# EAGLE design PIC32 (EAGLE 5.12)
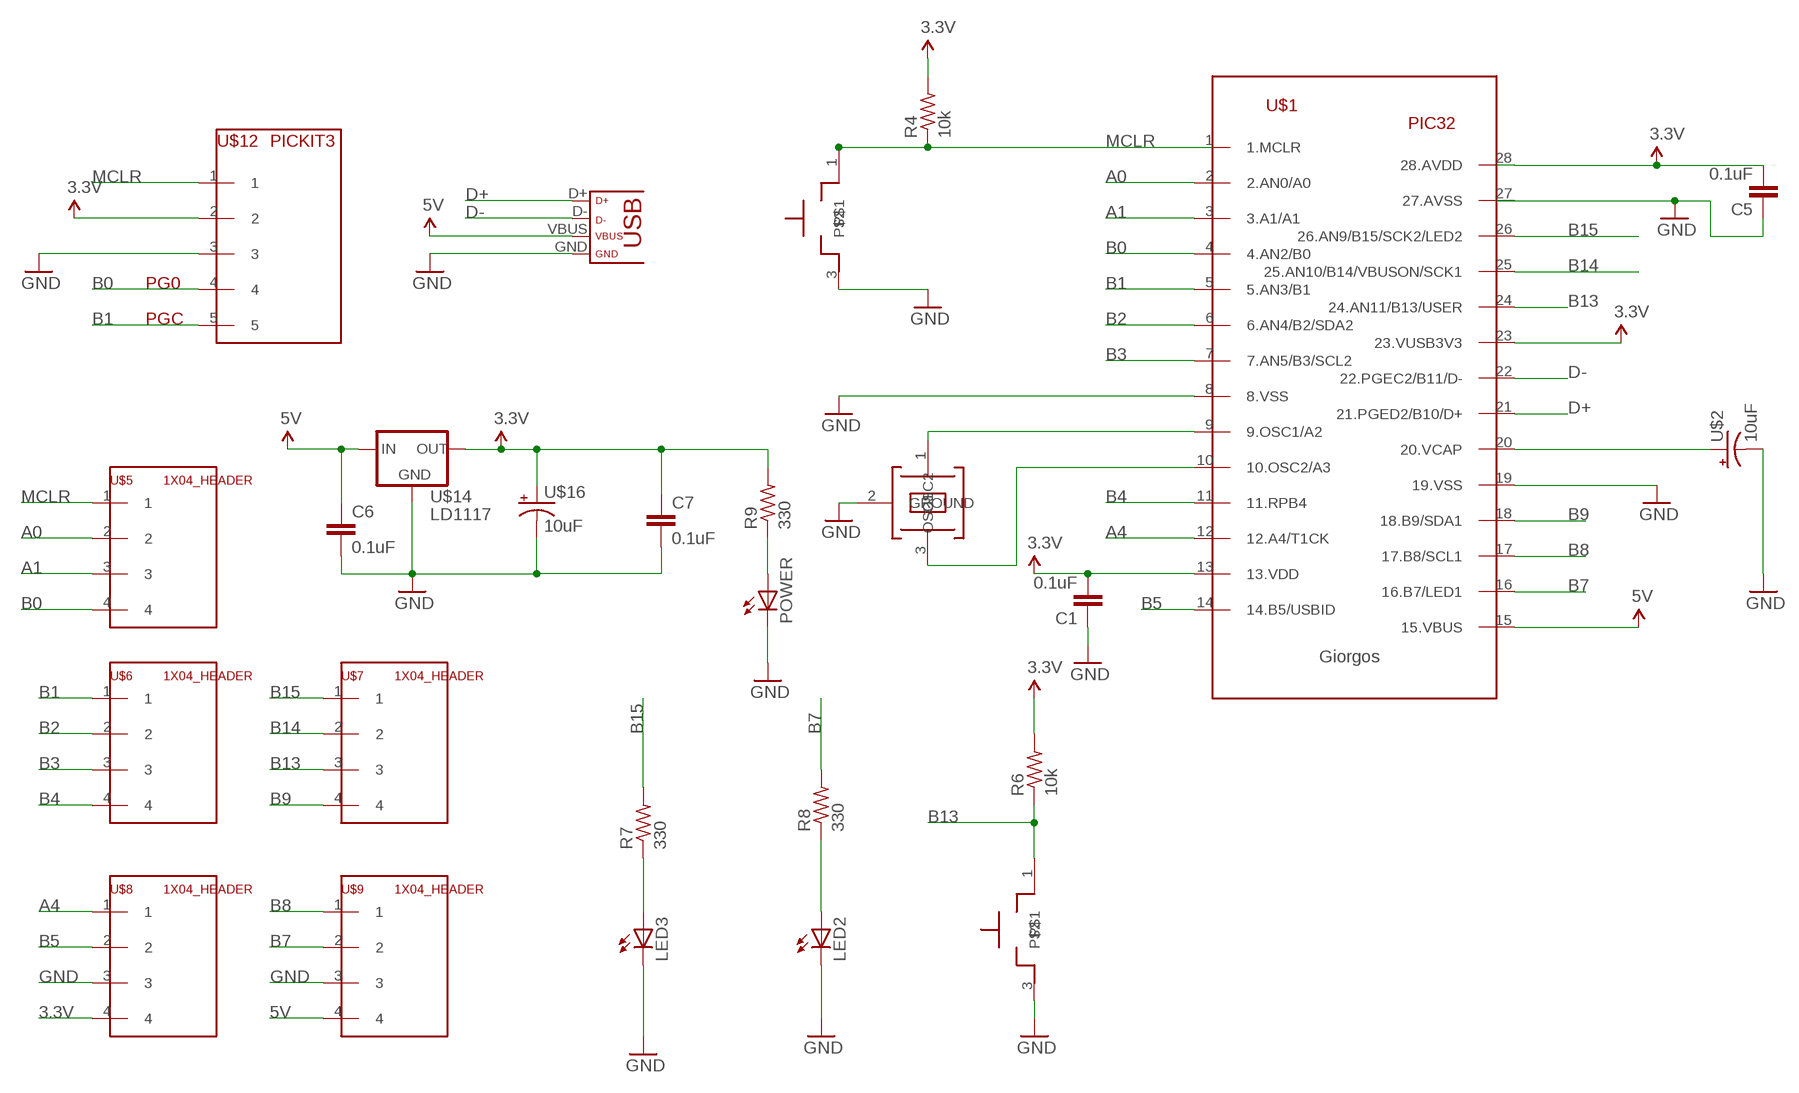
[diagram p0: schematic, sheet 1]

## Parts
C1  0.1uF  C-EU025-024X044  [C025-024X044]
C5  0.1uF  C-EU025-024X044  [C025-024X044]
C6  0.1uF  C-EU025-024X044  [C025-024X044]
C7  0.1uF  C-EU025-024X044  [C025-024X044]
LED2  LED3MM  [LED3MM]
LED3  LED3MM  [LED3MM]
POWER  LED3MM  [LED3MM]
R4  10k  R-US_0207/7  [0207/7]
R6  10k  R-US_0207/7  [0207/7]
R7  330  R-US_0207/7  [0207/7]
R8  330  R-US_0207/7  [0207/7]
R9  330  R-US_0207/7  [0207/7]
U$1  PIC32  [DIL28-3]
U$2  10uF  CAP_POL  [CAP_POL_D]
U$4  PUSHBUTTON  [1X03]
U$5  1X04_HEADER  [1X04]
U$6  1X04_HEADER  [1X04]
U$7  1X04_HEADER  [1X04]
U$8  1X04_HEADER  [1X04]
U$9  1X04_HEADER  [1X04]
U$10  PUSHBUTTON  [1X03]
U$11  USB  [USB-MINIB]
U$12  PICKIT3  [1X05]
U$14  LD1117  [TO220]
U$16  10uF  CAP_POL  [CAP_POL_D]
U$17  8MHZ_RESONATOR  [1X03]

## Nets
3.3V: C1.2 C5.2 C7.1 R4.2 R6.2 R9.2 U$1.13(13.VDD) U$1.23(23.VUSB3V3) U$1.28(28.AVDD) U$8.4 U$12.2 U$14.2(OUT) U$16.1(+)
5V: C6.1 U$1.15(15.VBUS) U$9.4 U$11.VBUS U$14.3(IN)
A0: U$1.2(2.AN0/A0) U$5.2
A1: U$1.3(3.A1/A1) U$5.3
A4: U$1.12(12.A4/T1CK) U$8.1
B0: U$1.4(4.AN2/B0) U$5.4 U$12.4
B1: U$1.5(5.AN3/B1) U$6.1 U$12.5
B2: U$1.6(6.AN4/B2/SDA2) U$6.2
B3: U$1.7(7.AN5/B3/SCL2) U$6.3
B4: U$1.11(11.RPB4) U$6.4
B5: U$1.14(14.B5/USBID) U$8.2
B7: R8.2 U$1.16(16.B7/LED1) U$9.2
B8: U$1.17(17.B8/SCL1) U$9.1
B9: U$1.18(18.B9/SDA1) U$7.4
B13: R6.1 U$1.24(24.AN11/B13/USER) U$7.3 U$10.1
B14: U$1.25(25.AN10/B14/VBUSON/SCK1) U$7.2
B15: R7.2 U$1.26(26.AN9/B15/SCK2/LED2) U$7.1
D+: U$1.21(21.PGED2/B10/D+) U$11.D+
D-: U$1.22(22.PGEC2/B11/D-) U$11.D-
GND: C1.1 C5.1 C6.2 C7.2 LED2.K(C) LED3.K(C) POWER.K(C) U$1.8(8.VSS) U$1.19(19.VSS) U$1.27(27.AVSS) U$2.2(-) U$4.3 U$8.3 U$9.3 U$10.3 U$11.GND U$12.3 U$14.1(GND) U$16.2(-) U$17.2(GROUND)
MCLR: R4.1 U$1.1(1.MCLR) U$4.1 U$5.1 U$12.1
N$1: U$1.9(9.OSC1/A2) U$17.1(OSC1)
N$2: U$1.10(10.OSC2/A3) U$17.3(OSC2)
N$3: U$1.20(20.VCAP) U$2.1(+)
N$4: LED2.A R8.1
N$5: LED3.A R7.1
N$7: POWER.A R9.1

## Library data of the parts
C1 C5-C7 = ME433:C-EU: CAPACITOR, European symbol
LED2 LED3 POWER = ME433:LED: LED OSRAM: - CHIPLED LG R971, LG N971, LY N971, LG Q971, LY Q971, LO R971, LY R971 LH N974, LH R974 LS Q976, LO Q976, LY Q976 LO Q996 - Hyper CHIPLED LW Q18S LB Q993, LB Q99A, LB R99A - SideLED LS A670, LO A670, LY A670, LG A670, LP A670 LB A673, LV A673, LT A673, LW A673 LH A674 LY A675 LS A676, LA A676, LO A676, LY A676, LW A676 LS A679, LY A679, LG A679 - Hyper Micro SIDELED® LS Y876, LA Y876, LO Y876, LY Y876 LT Y87S - SmartLED LW L88C, LW L88S LB L89C, LB L89S, LG L890 LS L89K, LO L89K, LY L89K LS L896, LA L896, LO L896, LY L896 - TOPLED LS T670, LO T670, LY T670, LG T670, LP T670 LSG T670, LSP T670, LSY T670, LOP T670, LYG T670 LG T671, LOG T671, LSG T671 LB T673, LV T673, LT T673, LW T673 LH T674 LS T676, LA T676, LO T676, LY T676, LB T676, LH T676, LSB T676, LW T676 LB T67C, LV T67C, LT T67C, LS T67K, LO T67K, LY T67K, LW E67C LS E67B, LA E67B, LO E67B, LY E67B, LB E67C, LV E67C, LT E67C LW T67C LS T679, LY T679, LG T679 LS T770, LO T770, LY T770, LG T770, LP T770 LB T773, LV T773, LT T773, LW T773 LH T774 LS E675, LA E675, LY E675, LS T675 LS T776, LA T776, LO T776, LY T776, LB T776 LHGB T686 LT T68C, LB T68C - Hyper Mini TOPLED® LB M676 - Mini TOPLED Santana® LG M470 LS M47K, LO M47K, LY M47K Source: http://www.osram.convergy.de LUXEON: - LUMILED® LXK2-PW12-R00, LXK2-PW12-S00, LXK2-PW14-U00, LXK2-PW14-V00 LXK2-PM12-R00, LXK2-PM12-S00, LXK2-PM14-U00 LXK2-PE12-Q00, LXK2-PE12-R00, LXK2-PE12-S00, LXK2-PE14-T00, LXK2-PE14-U00 LXK2-PB12-K00, LXK2-PB12-L00, LXK2-PB12-M00, LXK2-PB14-N00, LXK2-PB14-P00, LXK2-PB14-Q00 LXK2-PR12-L00, LXK2-PR12-M00, LXK2-PR14-Q00, LXK2-PR14-R00 LXK2-PD12-Q00, LXK2-PD12-R00, LXK2-PD12-S00 LXK2-PH12-R00, LXK2-PH12-S00 LXK2-PL12-P00, LXK2-PL12-Q00, LXK2-PL12-R00 Source: www.luxeon.com KINGBRIGHT: KA-3528ASYC Source: www.kingbright.com
R4 R6-R9 = resistor:R-US_: RESISTOR, American symbol
U$1 = ME433:PIC32
U$2 U$16 = ME433:CAP_POL
U$4 U$10 = ME433:PUSHBUTTON
U$5-U$9 = ME433:1X04_HEADER
U$11 = ME433:USB
U$12 = ME433:PICKIT3
U$14 = ME433:LD1117
U$17 = ME433:8MHZ_RESONATOR

## Board
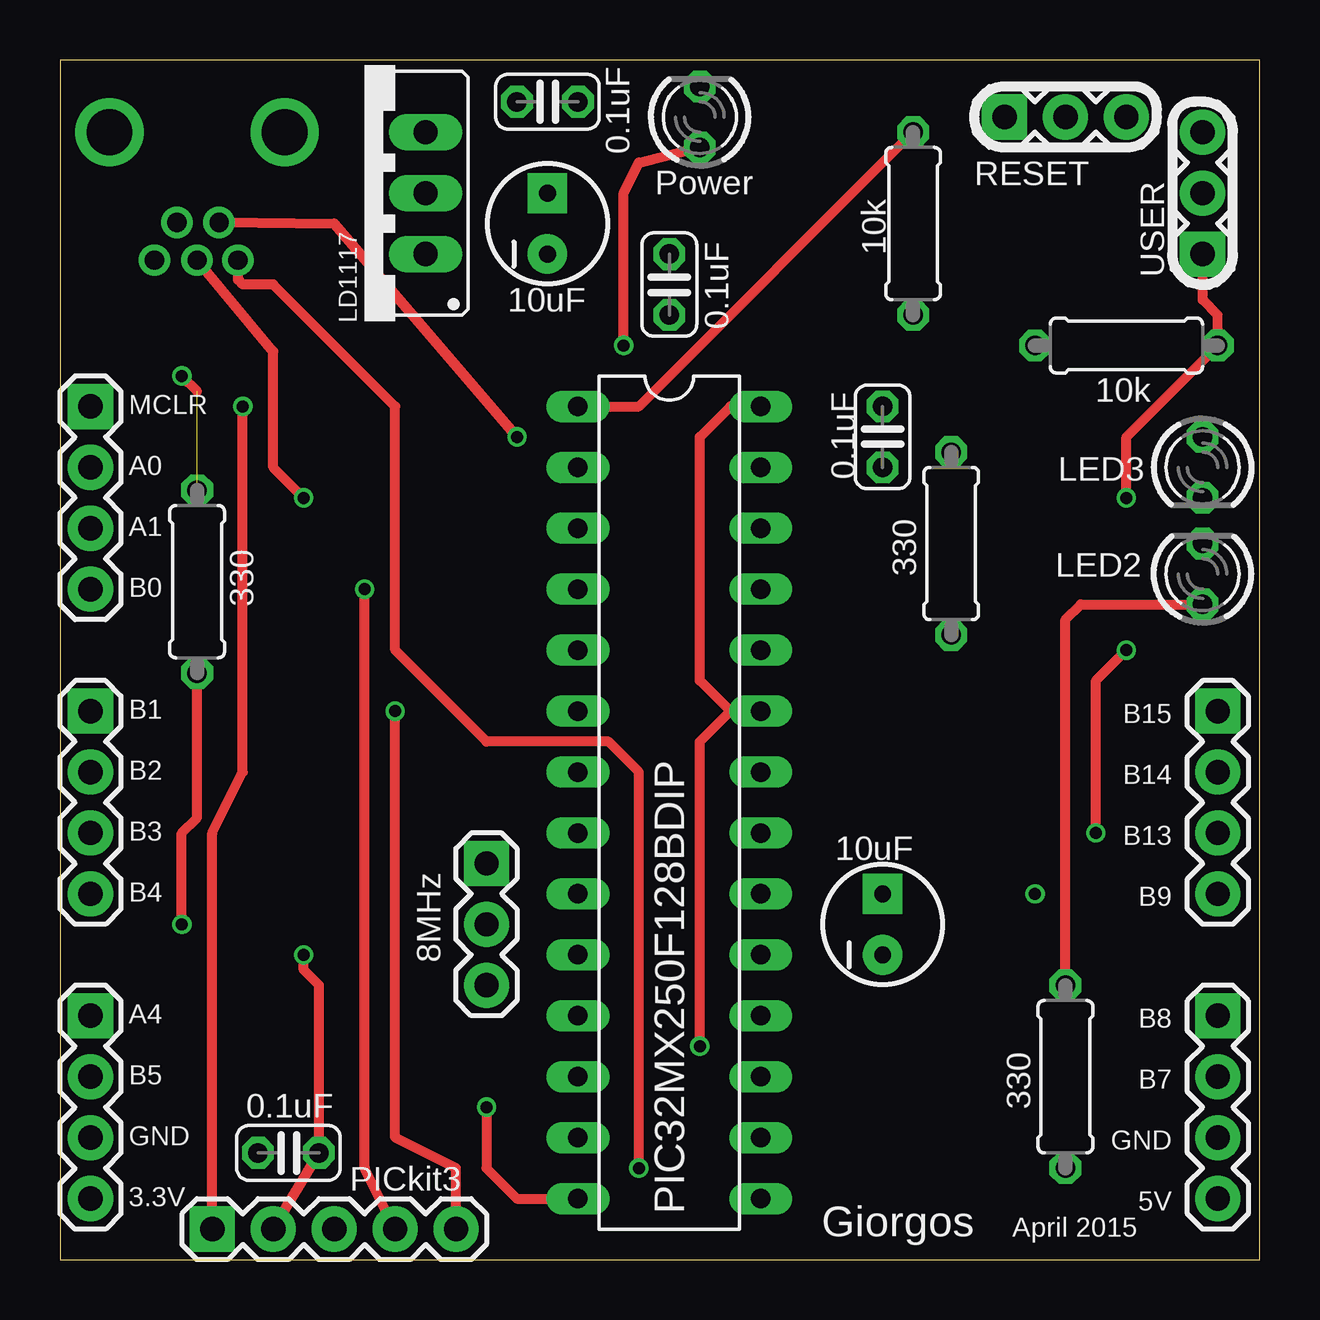
[diagram p1: board, top side]
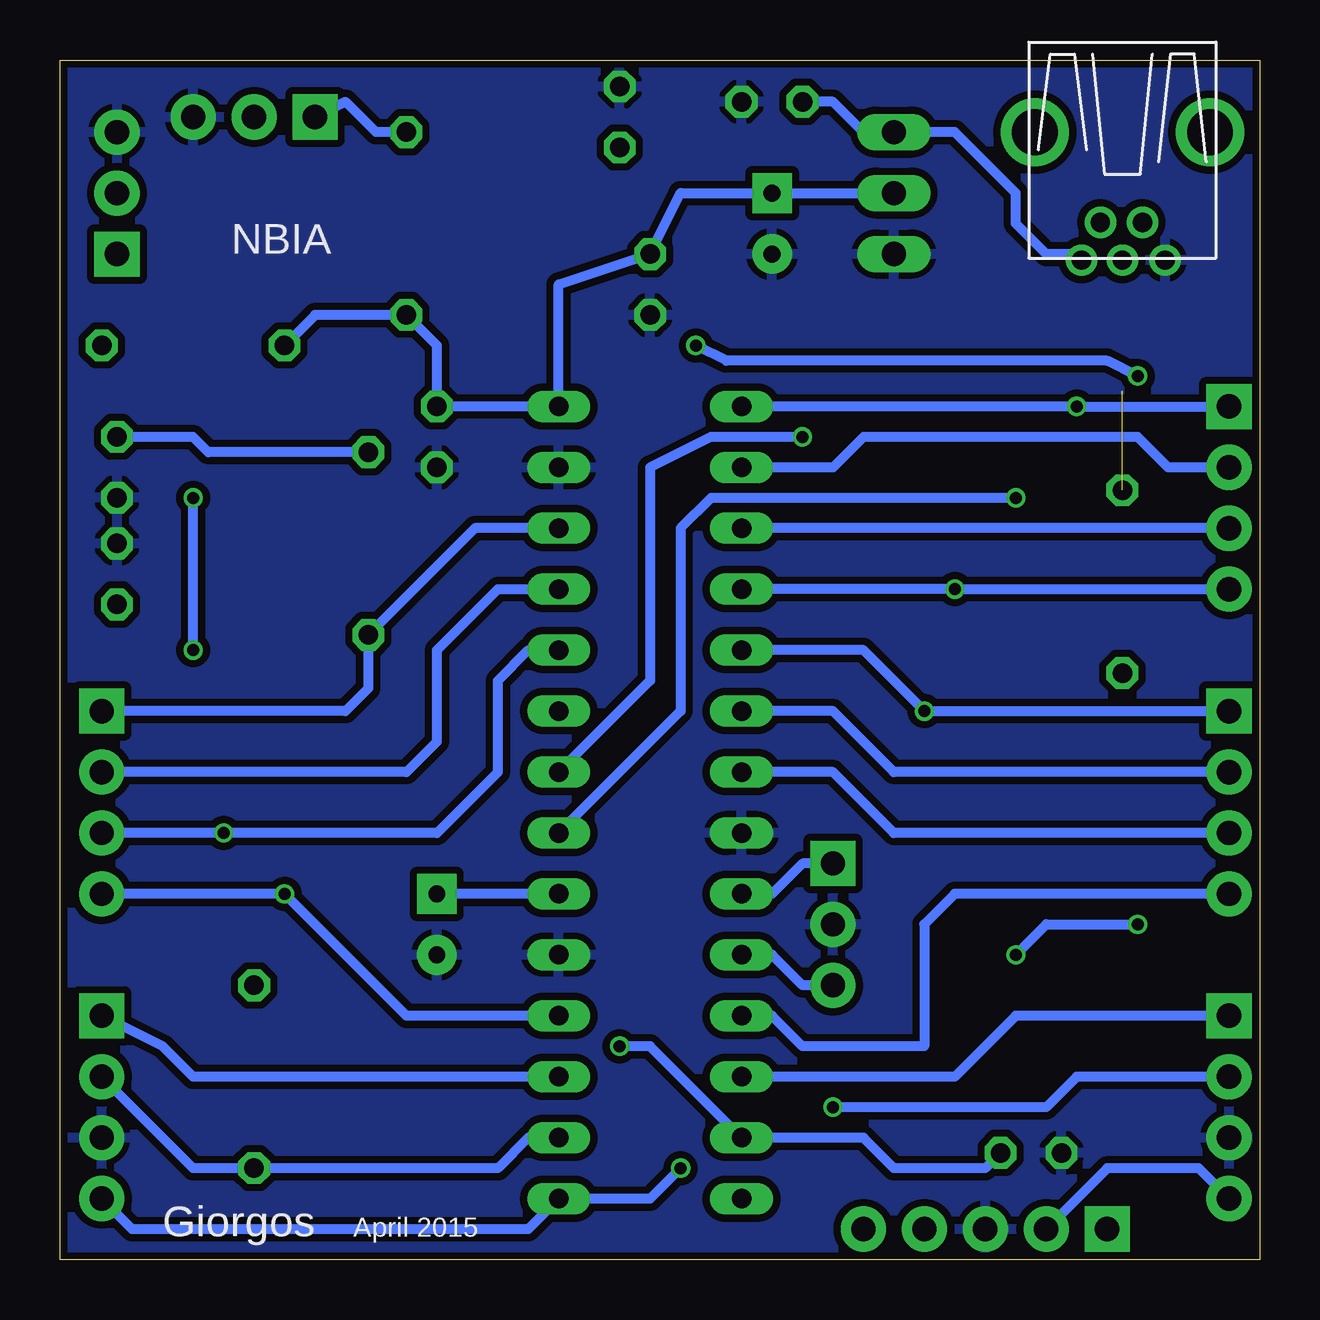
[diagram p2: board, bottom side, seen from below]

Size 50 x 50 mm. Coordinates in mm from the lower left corner, seen from the top.
Outline: 0,0 50,0 50,50 0,50 0,0
Copper layers (1*16): Top 0.035mm / dielectric 1.5mm / Bottom 0.035mm
Design rules "SeeedStudio_2layer_DRU_no_angle_20140221": minimum track width 6mil, minimum drill 12mil, track to track 6mil, track to pad 6mil, pad to pad 6mil, via to via 6mil, smd to smd 0mil, copper to edge 10mil, drill to drill 10mil, minimum pad ring 10mil, minimum via ring 6mil, stop-mask expansion 2mil, vias tented up to drill 100mil, thermal gap 10mil

### Footprints (pad centres in the part's own frame; a part is rotated, then mirrored left to right if it is on the bottom)
C025-024X044 = drill 0.813 octagon: 1 -1.27,0; 2 1.27,0
LED3MM = drill 0.813 octagon: A -1.27,0; K 1.27,0
0207/7 = drill 0.813 octagon: 1 -3.81,0; 2 3.81,0
DIL28-3 = drill 0.813 long: 1 -16.51,-3.81; 2 -13.97,-3.81; 3 -11.43,-3.81; 4 -8.89,-3.81; 5 -6.35,-3.81; 6 -3.81,-3.81; 7 -1.27,-3.81; 8 1.27,-3.81; 9 3.81,-3.81; 10 6.35,-3.81; 11 8.89,-3.81; 12 11.43,-3.81; 13 13.97,-3.81; 14 16.51,-3.81; 15 16.51,3.81; 16 13.97,3.81; 17 11.43,3.81; 18 8.89,3.81; 19 6.35,3.81; 20 3.81,3.81; 21 1.27,3.81; 22 -1.27,3.81; 23 -3.81,3.81; 24 -6.35,3.81; 25 -8.89,3.81; 26 -11.43,3.81; 27 -13.97,3.81; 28 -16.51,3.81
CAP_POL_D = drill 0.7 pad 1.651 square: 1 1.27,0 | drill 0.7 pad 1.651 round: 2 -1.27,0
1X03 = drill 1.016 pad 1.88 square: 1 0,0 | drill 1.016 pad 1.88 round: 2 2.54,0; 3 5.08,0
1X04 = drill 1.016 pad 1.88 square: 1 0,0 | drill 1.016 pad 1.88 round: 2 2.54,0; 3 5.08,0; 4 7.62,0
USB-MINIB = drill 0.8 round: D+ 4.064,0; D- 2.489,0.914; GND 4.064,-1.778; ID 2.489,-0.838; VBUS 4.064,1.702 | drill 1.9 round: P$6 -1.27,-3.65; P$7 -1.27,3.65
1X05 = drill 1.016 pad 1.88 square: 1 0,0 | drill 1.016 pad 1.88 round: 2 2.54,0; 3 5.08,0; 4 7.62,0; 5 10.16,0
TO220 = drill 1.016 long: 1 -2.54,0; 2 0,0; 3 2.54,0

### Placement (x,y rotation side)
C1  9.53,4.45 0 top
C5  34.29,34.29 90 top
C6  20.32,48.26 0 top
C7  25.4,40.64 270 top
LED2  47.62,28.57 90 top
LED3  47.62,33.02 270 top
POWER  26.67,47.62 90 top
R4  35.56,43.18 270 top
R6  44.45,38.1 180 top
R7  37.15,29.84 270 top
R8  41.91,7.62 270 top
R9  5.71,28.26 270 top
U$1  25.4,19.05 270 top
U$2  34.29,13.97 90 top
U$4  39.37,47.62 0 top
U$5  1.27,35.56 270 top
U$6  1.27,22.86 270 top
U$7  48.26,22.86 270 top
U$8  1.27,10.16 270 top
U$9  48.26,10.16 270 top
U$10  47.62,41.91 90 top
U$11  5.71,45.72 270 top
U$12  6.35,1.27 0 top
U$14  15.24,44.45 90 top
U$16  20.32,43.18 90 top
U$17  17.78,16.51 270 top

### Tracks (layer width: path | path; a pad name or v marks a point on that pad's centre or on a via)
3.3V  (via drill 0.5)
  Top 0.406: U$1.28 27.94,35.56 26.67,34.29 26.67,24.13 27.94,22.86 | U$12.2 C1.2 10.79,11.43 10.16,12.06 v10.16,12.7 | v26.67,8.89 26.67,21.59 27.94,22.86 | 27.94,22.86 U$1.23 | v5.08,13.97 5.08,17.78 5.71,18.41 R9.2
  Bottom 0.406: U$12.2 6.35,3.81 2.54,3.81 U$8.4 | U$14.2 U$16.1 24.13,44.45 C7.1 29.21,40.64 U$1.28 C5.2 34.29,38.1 R4.2 39.37,39.37 R6.2 | C1.2 11.43,3.81 15.24,3.81 16.51,5.08 U$1.13 25.4,8.89 v26.67,8.89 | v5.08,13.97 8.89,13.97 v10.16,12.7
5V  (via drill 0.5)
  Top 0.406: v24.13,3.81 24.13,20.32 22.86,21.59 17.78,21.59 13.97,25.4 13.97,35.56 8.89,40.64 7.62,40.64 7.42,40.84 U$11.VBUS
  Bottom 0.406: U$11.VBUS 7.04,41.91 8.89,41.91 10.16,43.18 10.16,44.45 12.7,46.99 U$14.3 16.51,46.99 17.78,48.26 C6.1 | v24.13,3.81 25.4,2.54 U$1.15 30.48,1.27 46.99,1.27 U$9.4
A0
  Bottom 0.406: U$5.2 3.81,33.02 5.08,34.29 16.51,34.29 17.78,33.02 U$1.2
A1
  Bottom 0.406: U$5.3 U$1.3
A4
  Bottom 0.406: U$8.1 10.16,10.16 12.7,7.62 U$1.12
B0  (via drill 0.5)
  Top 0.406: U$12.4 12.7,3.81 v12.7,27.94
  Bottom 0.406: U$5.4 v12.7,27.94 U$1.4
B1  (via drill 0.5)
  Top 0.406: U$12.5 16.51,3.81 13.97,5.08 v13.97,22.86
  Bottom 0.406: U$6.1 v13.97,22.86 16.51,25.4 U$1.5
B2
  Bottom 0.406: U$6.2 15.24,20.32 17.78,22.86 U$1.6
B3
  Bottom 0.406: U$6.3 15.24,17.78 17.78,20.32 U$1.7
B4
  Bottom 0.406: U$6.4 12.7,15.24 13.97,13.97 13.97,8.89 19.05,8.89 20.32,10.16 U$1.11
B5  (via drill 0.5)
  Top 0.406: v17.78,6.35 17.78,3.81 19.05,2.54 U$1.14
  Bottom 0.406: v17.78,6.35 8.89,6.35 7.62,7.62 U$8.2
B7
  Bottom 0.406: U$1.16 30.48,5.08 31.75,3.81 R8.2 44.45,3.81 U$9.2
B8
  Bottom 0.406: U$1.17 44.45,7.62 45.72,8.89 U$9.1
B9  (via drill 0.5)
  Bottom 0.406: U$1.18 35.56,10.16 v40.64,15.24 U$7.4
B13  (via drill 0.5)
  Top 0.406: U$10.1 47.62,40.01 48.26,39.37 R6.1 44.45,34.29 v44.45,31.75 | v44.45,25.4 43.18,24.13 v43.18,17.78
  Bottom 0.406: U$1.24 30.48,25.4 31.75,24.13 31.75,20.32 34.29,17.78 v43.18,17.78 U$7.3 | v44.45,25.4 v44.45,31.75
B14
  Bottom 0.406: U$1.25 31.75,27.94 34.29,25.4 34.29,21.59 35.56,20.32 U$7.2
B15
  Bottom 0.406: U$1.26 32.7,30.48 R7.2 37.15,23.81 38.1,22.86 U$7.1
D+  (via drill 0.5)
  Top 0.406: U$11.D+ 8.89,37.85 8.89,33.02 v10.16,31.75
  Bottom 0.406: v10.16,31.75 22.86,31.75 24.13,30.48 24.13,22.86 U$1.21
D-  (via drill 0.5)
  Top 0.406: U$11.D- 11.43,43.18 v19.05,34.29
  Bottom 0.406: U$1.22 25.4,24.13 25.4,33.02 22.86,34.29 v19.05,34.29
GND
  pour Bottom (isolate 0.305): 0,50.16 0,0 50.16,0 50.16,0.64 50.16,50.16
MCLR  (via drill 0.5)
  Top 0.406: U$1.1 24.13,35.56 R4.1 | U$12.1 6.35,17.78 7.62,20.32 v7.62,35.56
  Bottom 0.406: U$5.1 v7.62,35.56 U$1.1 | R4.1 36.83,46.99 38.1,48.26 U$4.1
N$1
  Bottom 0.406: U$17.1 19.05,16.51 20.32,15.24 U$1.9
N$2
  Bottom 0.406: U$17.3 19.05,11.43 20.32,12.7 U$1.10
N$3
  Bottom 0.406: U$1.20 U$2.1
N$4
  Top 0.406: LED2.A 42.55,27.3 41.91,26.67 R8.1
N$5
  Bottom 0.406: R7.1 43.81,33.66 44.45,34.29 LED3.A
N$7  (via drill 0.5)  (1 unrouted)
  Top 0.406: POWER.A 24.13,45.72 23.5,44.45 v23.5,38.1 | v5.08,36.83 5.71,36.2
  Bottom 0.406: v23.5,38.1 22.23,37.47 6.35,37.47 v5.08,36.83

### Text on the board
tPlace: Power | RESET | USER | MCLR | A0 | A1 | B0 | B1 | B15 | B14 | B2 | B13 | B3 | B9 | B4 | 8MHz | A4 | B8 | B7 | B5 | GND | GND | PICkit3 | 5V | 3.3V | PIC32MX250F128BDIP | Giorgos | April 2015
bPlace: NBIA | April 2015 | Giorgos